# EAGLE schematic controller (EAGLE 7.7.0)
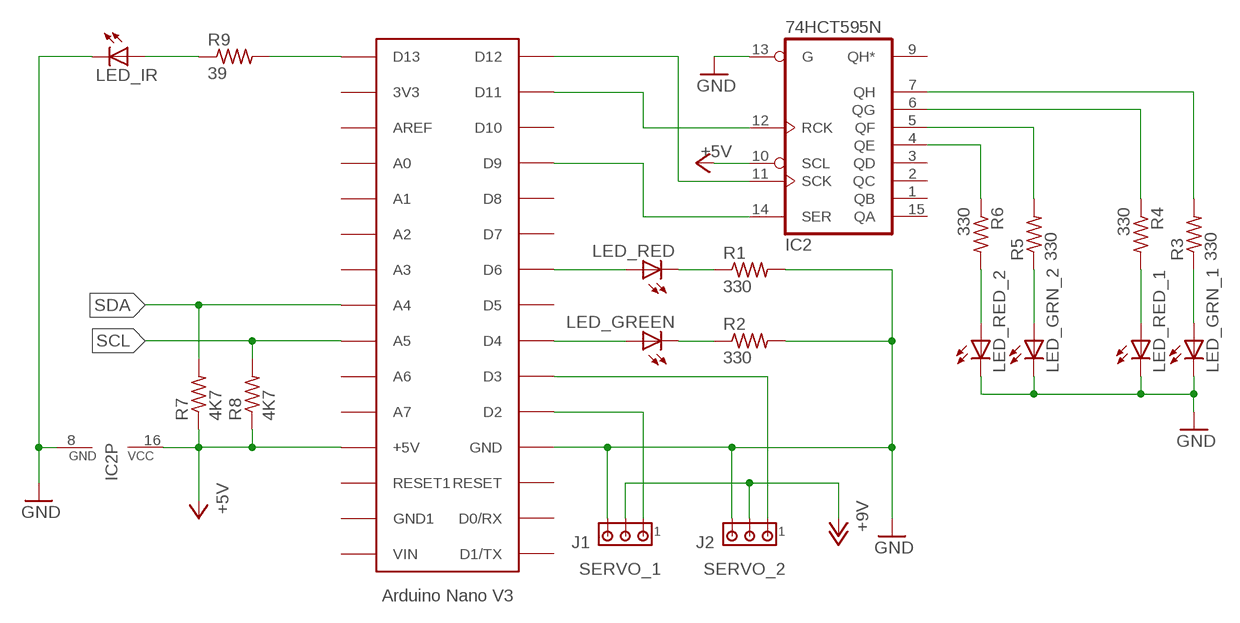
[diagram p0: schematic, sheet 1]

## Parts
IC2  74HCT595N  [DIL16]
J1  SERVO_1  MTA03-100  [10X03MTA]
J2  SERVO_2  MTA03-100  [10X03MTA]
LED_GREEN  LED5MM  [LED5MM]
LED_GRN_1  LED5MM  [LED5MM]
LED_GRN_2  LED5MM  [LED5MM]
LED_IR  LED5MM  [LED5MM]
LED_RED  LED5MM  [LED5MM]
LED_RED_1  LED5MM  [LED5MM]
LED_RED_2  LED5MM  [LED5MM]
R1  330  R-US_0207/10  [0207/10]
R2  330  R-US_0207/10  [0207/10]
R3  330  R-US_0207/10  [0207/10]
R4  330  R-US_0207/10  [0207/10]
R5  330  R-US_0207/10  [0207/10]
R6  330  R-US_0207/10  [0207/10]
R7  4K7  R-US_0207/10  [0207/10]
R8  4K7  R-US_0207/10  [0207/10]
R9  39  R-US_0207/10  [0207/10]
U$1  ARDUINONANO  [PDIP-32]

## Nets
+5V: IC2.10(SCL) IC2.16(VCC) R7.1 R8.1 U$1.+5V
+12V: J1.2 J2.2 ; supply symbol labelled +9V
GND: IC2.8(GND) IC2.13(G) J1.3 J2.3 LED_GRN_1.K(C) LED_GRN_2.K(C) LED_IR.K(C) LED_RED_1.K(C) LED_RED_2.K(C) R1.2 R2.2 U$1.GND
N$1: IC2.14(SER) U$1.D9
N$2: IC2.11(SCK) U$1.D12
N$3: IC2.12(RCK) U$1.D11
N$4: LED_GREEN.A U$1.D4
N$5: LED_RED.A U$1.D6
N$6: LED_RED.K(C) R1.1
N$7: LED_GREEN.K(C) R2.1
N$8: LED_IR.A R9.1
N$9: R9.2 U$1.D13
N$10: IC2.4(QE) R6.1
N$11: IC2.5(QF) R5.2
N$12: IC2.6(QG) R4.1
N$13: IC2.7(QH) R3.2
N$14: LED_GRN_1.A R3.1
N$15: LED_RED_1.A R4.2
N$16: LED_GRN_2.A R5.1
N$17: LED_RED_2.A R6.2
N$18: J1.1 U$1.D2
N$19: J2.1 U$1.D3
SCL: R8.2 U$1.A2(A5)
SDA: R7.2 U$1.A3(A4)
Unconnected: IC2.1(QB) IC2.2(QC) IC2.3(QD) IC2.9(QH*) IC2.15(QA) U$1.3V3 U$1.A0(A7) U$1.A1(A6) U$1.A4(A3) U$1.A5(A2) U$1.A6(A1) U$1.A7(A0) U$1.AREF U$1.D0/RX U$1.D1/TX U$1.D5 U$1.D7 U$1.D8 U$1.D10 U$1.GND1 U$1.RESET U$1.RESET1 U$1.VIN

## Library data of the parts
IC2 = 74xx-eu:74*595: 8-bit SHIFT REGISTER, output latch
J1 J2 = con-amp:MTA03-100: AMP connector
LED_GREEN LED_GRN_1 LED_GRN_2 LED_IR LED_RED LED_RED_1 LED_RED_2 = led:LED: LED OSRAM: - CHIPLED LG R971, LG N971, LY N971, LG Q971, LY Q971, LO R971, LY R971 LH N974, LH R974 LS Q976, LO Q976, LY Q976 LO Q996 - Hyper CHIPLED LW Q18S LB Q993, LB Q99A, LB R99A - SideLED LS A670, LO A670, LY A670, LG A670, LP A670 LB A673, LV A673, LT A673, LW A673 LH A674 LY A675 LS A676, LA A676, LO A676, LY A676, LW A676 LS A679, LY A679, LG A679 - Hyper Micro SIDELED® LS Y876, LA Y876, LO Y876, LY Y876 LT Y87S - SmartLED LW L88C, LW L88S LB L89C, LB L89S, LG L890 LS L89K, LO L89K, LY L89K LS L896, LA L896, LO L896, LY L896 - TOPLED LS T670, LO T670, LY T670, LG T670, LP T670 LSG T670, LSP T670, LSY T670, LOP T670, LYG T670 LG T671, LOG T671, LSG T671 LB T673, LV T673, LT T673, LW T673 LH T674 LS T676, LA T676, LO T676, LY T676, LB T676, LH T676, LSB T676, LW T676 LB T67C, LV T67C, LT T67C, LS T67K, LO T67K, LY T67K, LW E67C LS E67B, LA E67B, LO E67B, LY E67B, LB E67C, LV E67C, LT E67C LW T67C LS T679, LY T679, LG T679 LS T770, LO T770, LY T770, LG T770, LP T770 LB T773, LV T773, LT T773, LW T773 LH T774 LS E675, LA E675, LY E675, LS T675 LS T776, LA T776, LO T776, LY T776, LB T776 LHGB T686 LT T68C, LB T68C - Hyper Mini TOPLED® LB M676 - Mini TOPLED Santana® LG M470 LS M47K, LO M47K, LY M47K Source: http://www.osram.convergy.de LUXEON: - LUMILED® LXK2-PW12-R00, LXK2-PW12-S00, LXK2-PW14-U00, LXK2-PW14-V00 LXK2-PM12-R00, LXK2-PM12-S00, LXK2-PM14-U00 LXK2-PE12-Q00, LXK2-PE12-R00, LXK2-PE12-S00, LXK2-PE14-T00, LXK2-PE14-U00 LXK2-PB12-K00, LXK2-PB12-L00, LXK2-PB12-M00, LXK2-PB14-N00, LXK2-PB14-P00, LXK2-PB14-Q00 LXK2-PR12-L00, LXK2-PR12-M00, LXK2-PR14-Q00, LXK2-PR14-R00 LXK2-PD12-Q00, LXK2-PD12-R00, LXK2-PD12-S00 LXK2-PH12-R00, LXK2-PH12-S00 LXK2-PL12-P00, LXK2-PL12-Q00, LXK2-PL12-R00 Source: www.luxeon.com KINGBRIGHT: KA-3528ASYC Source: www.kingbright.com
R1-R9 = resistor:R-US_: RESISTOR, American symbol
U$1 = arduino-nano:ARDUINONANO: Arduino Nano